# Altium schematic sheet KF01A-D.SchDoc
size B
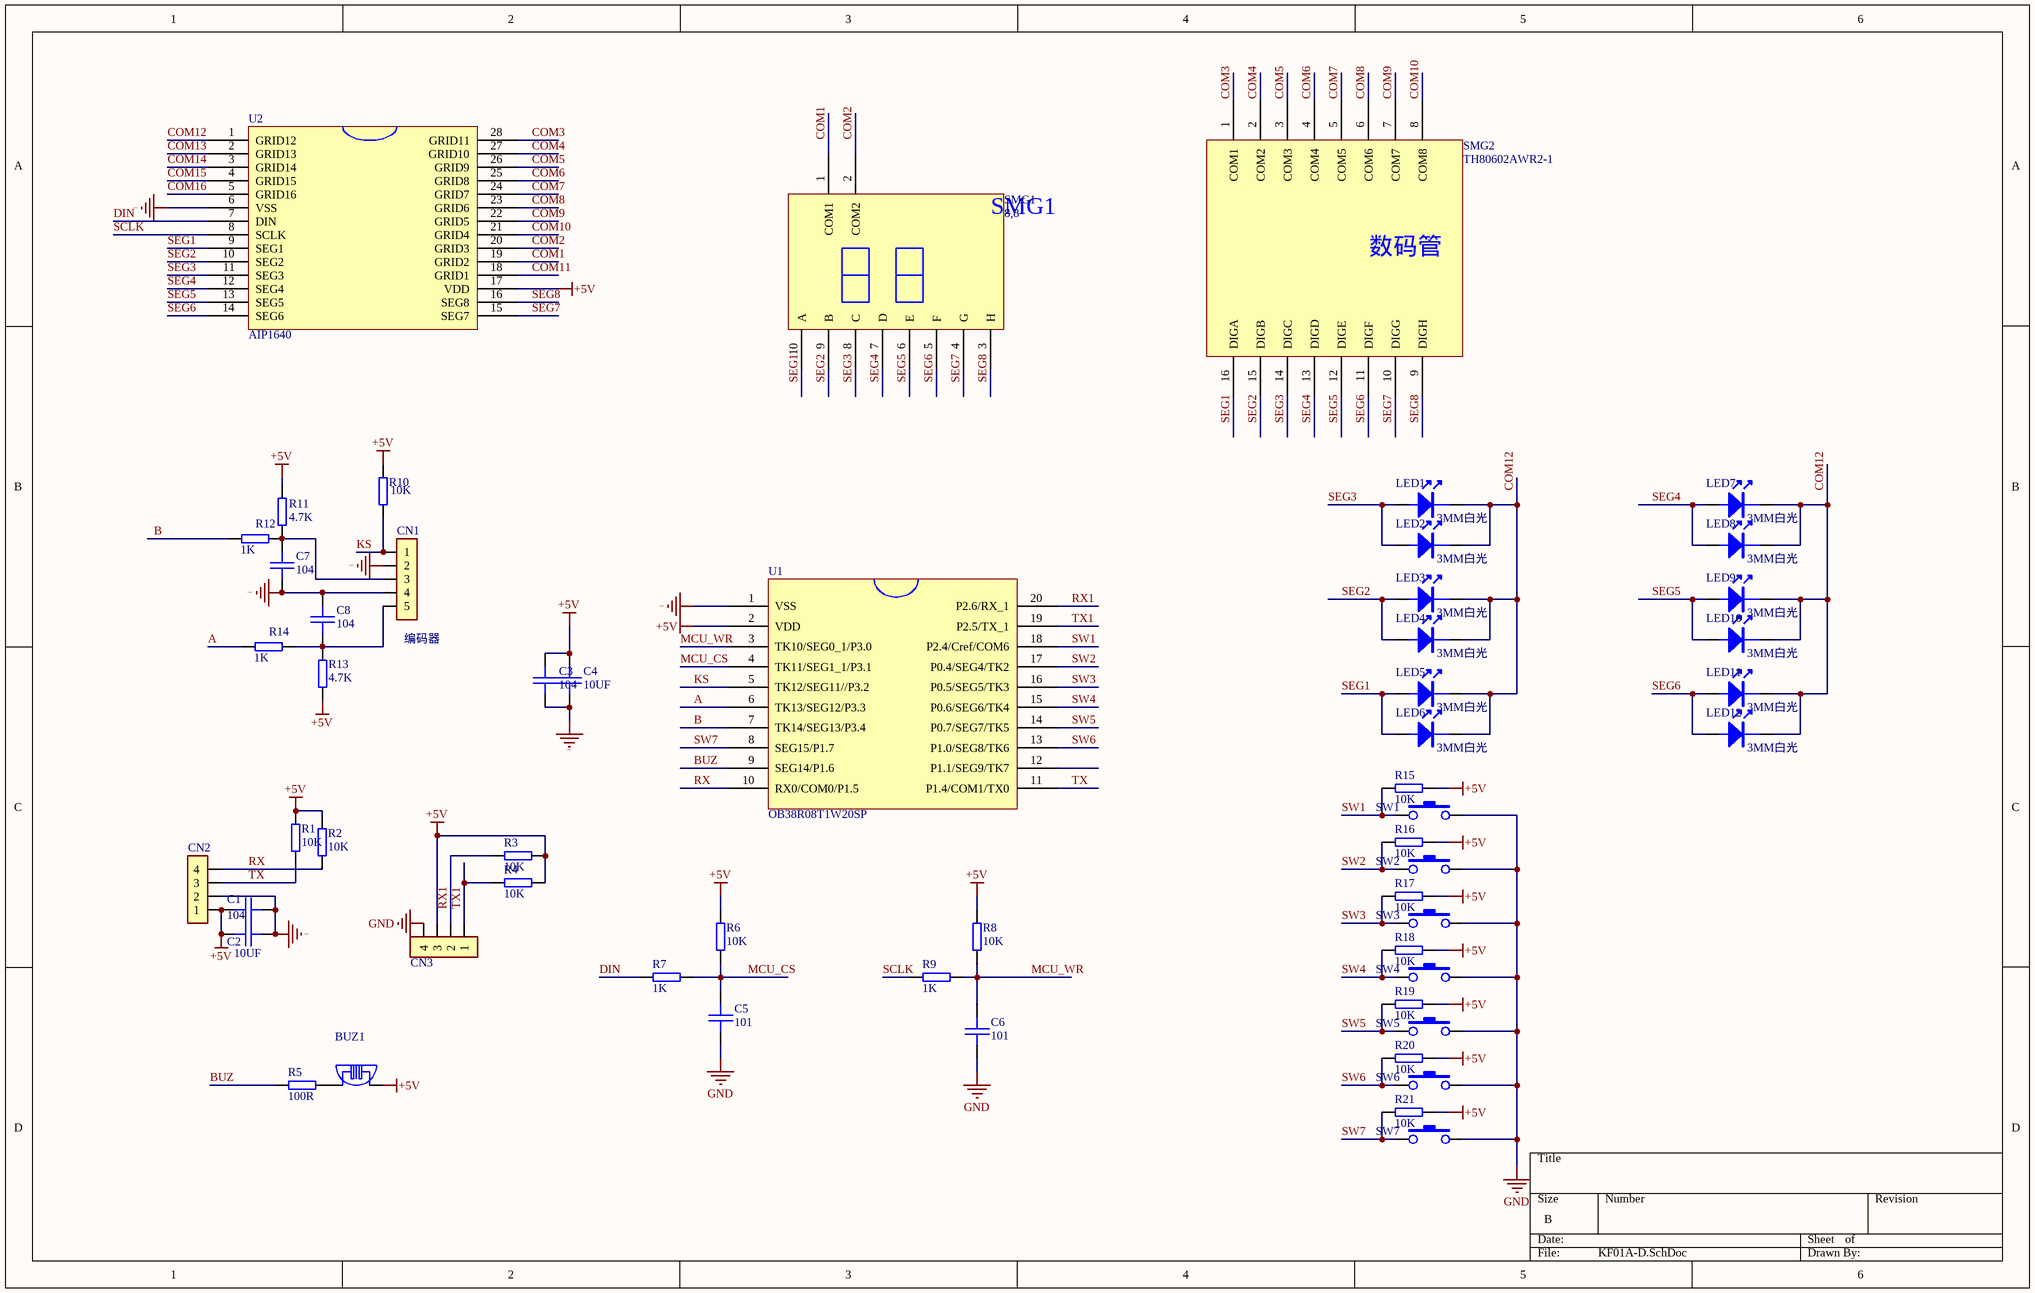
[diagram p0: KF01A-D.SchDoc]

## Parts
BUZ1  (no value)  [BUZ-7.5-15-AI]
C1  104  [c0805]
C2  10UF  [c1206]
C3  104  [c0805]
C4  10UF  [c1206]
C5  101  [c0805]
C6  101  [c0805]
C7  104  [c0805]
C8  104  [c0805]
CN1  编码器  [编码器]
CN2  (no value)  [CN-2.54-4-X]
CN3  (no value)  [CN-2.54-4-P]
LED1  3MM白光  [led3]
LED2  3MM白光  [led3]
LED3  3MM白光  [led3]
LED4  3MM白光  [led3]
LED5  3MM白光  [led3]
LED6  3MM白光  [led3]
LED7  3MM白光  [led3]
LED8  3MM白光  [led3]
LED9  3MM白光  [led3]
LED10  3MM白光  [led3]
LED11  3MM白光  [led3]
LED12  3MM白光  [led3]
R1  10K  [R0805]
R2  10K  [R0805]
R3  10K  [R0805]
R4  10K  [R0805]
R5  100R  [R0805]
R6  10K  [R0805]
R7  1K  [R0805]
R8  10K  [R0805]
R9  1K  [R0805]
R10  10K  [R0805]
R11  4.7K  [R0805]
R12  1K  [R0805]
R13  4.7K  [R0805]
R14  1K  [R0805]
R15  10K  [R0805]
R16  10K  [R0805]
R17  10K  [R0805]
R18  10K  [R0805]
R19  10K  [R0805]
R20  10K  [R0805]
R21  10K  [R0805]
SMG1  8,8  [TH34251AW1-1]
SMG2  TH80602AWR2-1  [TH80602AWR2-1]
SW1  (no value)  [KEY-4/4]
SW2  (no value)  [KEY-4/4]
SW3  (no value)  [KEY-4/4]
SW4  (no value)  [KEY-4/4]
SW5  (no value)  [KEY-4/4]
SW6  (no value)  [KEY-4/4]
SW7  (no value)  [KEY-4/4]
U1  OB38R08T1W20SP  [SOP20]
U2  AIP1640  [SOP28]

## Nets
+5V: BUZ1.2 C1.2 C2.2 C3.1 C4.1 CN2.1 CN3.3 R1.2 R2.2 R3.1 R4.1 R6.2 R8.2 R10.2 R11.1 R13.2 R15.1 R16.1 R17.1 R18.1 R19.1 R20.1 R21.1 U1.2(VDD) U2.17(VDD)
GND: C1.1 C2.1 C3.2 C4.2 C5.2 C6.2 C7.2 C8.1 CN1.2 CN1.4 CN2.2 CN3.4 SW1.2 SW2.2 SW3.2 SW4.2 SW5.2 SW6.2 SW7.2 U1.1(VSS) U2.6(VSS)
A: R14.1 U1.6(TK13/SEG12/P3.3)
B: R12.1 U1.7(TK14/SEG13/P3.4)
BUZ: R5.2 U1.9(SEG14/P1.6)
COM1: SMG1.1(COM1) U2.19(GRID2)
COM2: SMG1.2(COM2) U2.20(GRID3)
COM3: SMG2.1(COM1) U2.28(GRID11)
COM4: SMG2.2(COM2) U2.27(GRID10)
COM5: SMG2.3(COM3) U2.26(GRID9)
COM6: SMG2.4(COM4) U2.25(GRID8)
COM7: SMG2.5(COM5) U2.24(GRID7)
COM8: SMG2.6(COM6) U2.23(GRID6)
COM9: SMG2.7(COM7) U2.22(GRID5)
COM10: SMG2.8(COM8) U2.21(GRID4)
COM11: U2.18(GRID1)
COM12: LED1.K LED2.K LED3.K LED4.K LED5.K LED6.K LED7.K LED8.K LED9.K LED10.K LED11.K LED12.K U2.1(GRID12)
COM13: U2.2(GRID13)
COM14: U2.3(GRID14)
COM15: U2.4(GRID15)
COM16: U2.5(GRID16)
DIN: R7.2 U2.7(DIN)
KS: CN1.1 R10.1 U1.5(TK12/SEG11//P3.2)
MCU_CS: C5.1 R6.1 R7.1 U1.4(TK11/SEG1_1/P3.1)
MCU_WR: C6.1 R8.1 R9.1 U1.3(TK10/SEG0_1/P3.0)
RX: CN2.4 R2.1 U1.10(RX0/COM0/P1.5)
RX1: CN3.2 R3.2 U1.20(P2.6/RX_1)
SCLK: R9.2 U2.8(SCLK)
SEG1: LED5.A LED6.A SMG1.10(A) SMG2.16(DIGA) U2.9(SEG1)
SEG2: LED3.A LED4.A SMG1.9(B) SMG2.15(DIGB) U2.10(SEG2)
SEG3: LED1.A LED2.A SMG1.8(C) SMG2.14(DIGC) U2.11(SEG3)
SEG4: LED7.A LED8.A SMG1.7(D) SMG2.13(DIGD) U2.12(SEG4)
SEG5: LED9.A LED10.A SMG1.6(E) SMG2.12(DIGE) U2.13(SEG5)
SEG6: LED11.A LED12.A SMG1.5(F) SMG2.11(DIGF) U2.14(SEG6)
SEG7: SMG1.4(G) SMG2.10(DIGG) U2.15(SEG7)
SEG8: SMG1.3(H) SMG2.9(DIGH) U2.16(SEG8)
SW1: R15.2 SW1.1 U1.18(P2.4/Cref/COM6)
SW2: R16.2 SW2.1 U1.17(P0.4/SEG4/TK2)
SW3: R17.2 SW3.1 U1.16(P0.5/SEG5/TK3)
SW4: R18.2 SW4.1 U1.15(P0.6/SEG6/TK4)
SW5: R19.2 SW5.1 U1.14(P0.7/SEG7/TK5)
SW6: R20.2 SW6.1 U1.13(P1.0/SEG8/TK6)
SW7: R21.2 SW7.1 U1.8(SEG15/P1.7)
TX: CN2.3 R1.1 U1.11(P1.4/COM1/TX0)
TX1: CN3.1 R4.2 U1.19(P2.5/TX_1)
NetBUZ1_1: BUZ1.1 R5.1
NetC7_1: C7.1 CN1.3 R11.2 R12.2
NetC8_2: C8.2 CN1.5 R13.1 R14.2

Not connected (* = marked no-connect by the designer): U1 12(P1.1/SEG9/TK7)

## Notes on the sheet
- (in symbol TH80602AWR2-1) 数码管

## Library data of the parts
BUZ1 = BUZ
C1-C8 = C: CAP
CN1 = CN5
CN2 CN3 = CN4
LED1-LED12 = DL: LED
R1-R21 = R: RES
SW1-SW7 = KQ: KEY
U1 = IC-20
U2 = TM1628